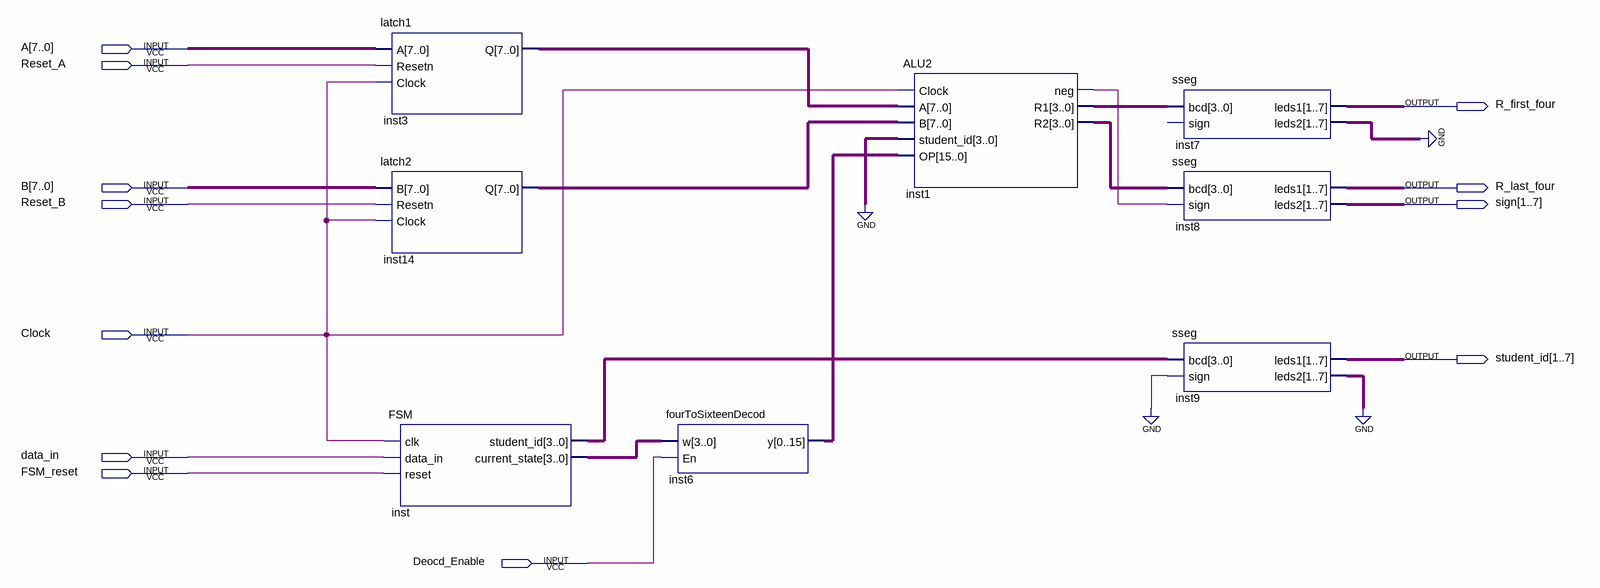
[diagram p0: schematic sheet]
// Quartus schematic Problem2.bdf as structural Verilog: 8 symbols, 12 pins
module Problem2 (
  input  [7:0] A,
  input  Reset_A,
  input  [7:0] B,
  input  Reset_B,
  input  Clock,
  input  data_in,
  input  FSM_reset,
  input  Deocd_Enable,
  output R_first_four,
  output R_last_four,
  output [1:7] sign,
  output [1:7] student_id
);

  wire inst1_neg;
  wire [3:0] inst1_r1, inst1_r2, inst_current_state, inst_student_id;
  wire [6:0] inst7_leds1, inst7_leds2, inst8_leds1, inst9_leds2;
  wire [7:0] inst3_q, inst14_q;
  wire [15:0] inst6_y;

  latch1 inst3 (.A(A), .Resetn(Reset_A), .Clock(Clock), .Q(inst3_q));
  latch2 inst14 (.B(B), .Resetn(Reset_B), .Clock(Clock), .Q(inst14_q));
  FSM inst (
    .clk(Clock), .data_in(data_in), .reset(FSM_reset), .student_id(inst_student_id),
    .current_state(inst_current_state));
  fourToSixteenDecod inst6 (.w(inst_current_state), .En(Deocd_Enable), .y(inst6_y));
  ALU2 inst1 (
    .Clock(Clock), .A(inst3_q), .B(inst14_q), .student_id(4'b0000), .OP(inst6_y), .neg(inst1_neg),
    .R1(inst1_r1), .R2(inst1_r2));
  sseg inst7 (.bcd(inst1_r1), .leds1(inst7_leds1), .leds2(inst7_leds2));  // open: sign
  sseg inst8 (.bcd(inst1_r2), .sign(inst1_neg), .leds1(inst8_leds1), .leds2(sign));
  sseg inst9 (.bcd(inst_student_id), .sign(1'b0), .leds1(student_id), .leds2(inst9_leds2));
  // also tied to GND on the sheet: {inst7_leds2[0], inst7_leds2[1], inst7_leds2[2], inst7_leds2[3], inst7_leds2[4], inst7_leds2[5], inst7_leds2[6], inst9_leds2[0], inst9_leds2[1], inst9_leds2[2], inst9_leds2[3], inst9_leds2[4], inst9_leds2[5], inst9_leds2[6]}
endmodule
